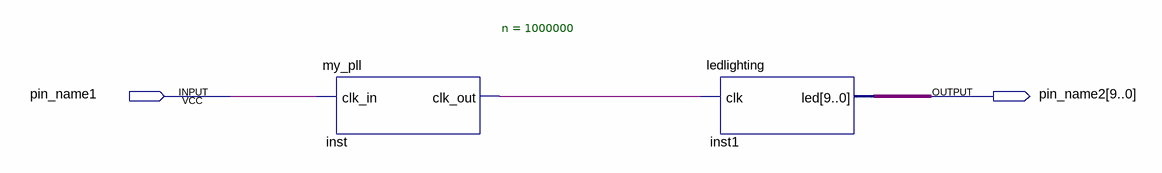
[diagram p0: schematic sheet]
// Quartus schematic Block2.bdf as structural Verilog: 2 symbols, 2 pins
module Block2 (
  input  pin_name1,
  output [9:0] pin_name2
);

  wire inst_clk_out;

  my_pll #(.n(1000000)) inst (.clk_in(pin_name1), .clk_out(inst_clk_out));
  ledlighting inst1 (.clk(inst_clk_out), .led(pin_name2));
endmodule
